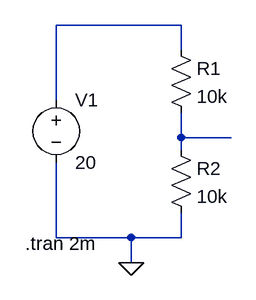
[diagram p0: schematic VOLATGE DIVDER.asc]
VOLATGE DIVDER.asc, the LTspice schematic file:
Version 4
SHEET 1 880 680
WIRE 256 32 96 32
WIRE 256 64 256 32
WIRE 96 128 96 32
WIRE 256 176 256 144
WIRE 320 176 256 176
WIRE 256 192 256 176
WIRE 96 304 96 208
WIRE 192 304 96 304
WIRE 256 304 256 272
WIRE 256 304 192 304
WIRE 192 336 192 304
FLAG 192 336 0
SYMBOL res 240 48 R0
SYMATTR InstName R1
SYMATTR Value 10k
SYMBOL res 240 176 R0
SYMATTR InstName R2
SYMATTR Value 10k
SYMBOL voltage 96 112 R0
SYMATTR InstName V1
SYMATTR Value 20
TEXT 56 312 Left 2 !.tran 2m

The netlist it stands for:
* VOLATGE DIVDER.asc
R1 N001 N002 10k
R2 N002 0 10k
V1 N001 0 20
.tran 2m
.backanno
.end